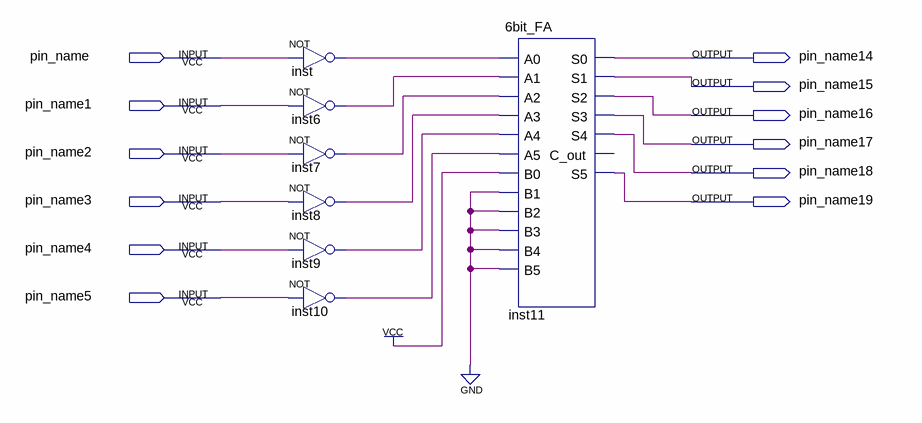
[diagram p0: schematic sheet]
// Quartus schematic 2th_complement.bdf as structural Verilog: 7 symbols, 12 pins
module \2th_complement  (
  input  pin_name,
  input  pin_name1,
  input  pin_name2,
  input  pin_name3,
  input  pin_name4,
  input  pin_name5,
  output pin_name14,
  output pin_name15,
  output pin_name16,
  output pin_name17,
  output pin_name18,
  output pin_name19
);

  wire inst6_out, inst7_out, inst8_out, inst9_out, inst10_out, inst_out;

  not inst (inst_out, pin_name);
  not inst6 (inst6_out, pin_name1);
  not inst7 (inst7_out, pin_name2);
  not inst8 (inst8_out, pin_name3);
  not inst9 (inst9_out, pin_name4);
  not inst10 (inst10_out, pin_name5);
  \6bit_FA  inst11 (
    .A0(inst_out), .A1(inst6_out), .A2(inst7_out), .A3(inst8_out), .A4(inst9_out), .A5(inst10_out),
    .B0(1'b1), .B1(1'b0), .B2(1'b0), .B3(1'b0), .B4(1'b0), .B5(1'b0), .S0(pin_name14), .S1(pin_name15),
    .S2(pin_name16), .S3(pin_name17), .S4(pin_name18), .S5(pin_name19));  // open: C_out
endmodule
